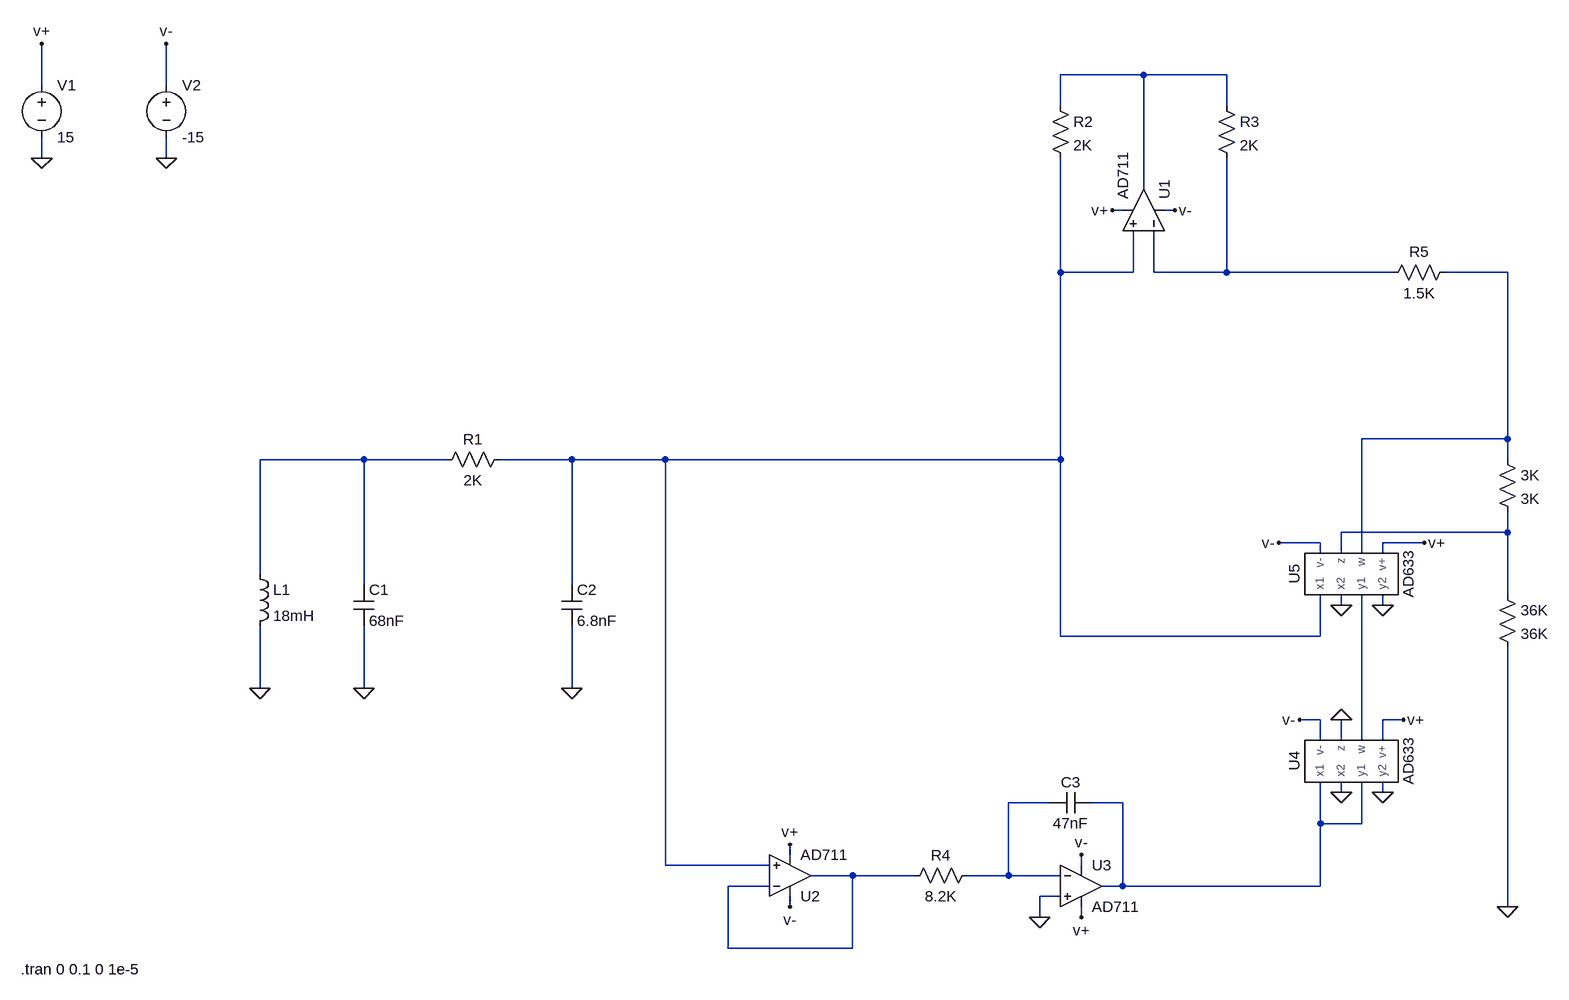
[diagram p0: schematic Draft1.asc]
Draft1.asc, the LTspice schematic file:
Version 4.1
SHEET 1 1716 784
WIRE 1088 -608 960 -608
WIRE 1216 -608 1088 -608
WIRE -608 -592 -608 -656
WIRE -416 -592 -416 -656
WIRE 960 -560 960 -608
WIRE 1216 -560 1216 -608
WIRE -608 -480 -608 -512
WIRE -416 -480 -416 -512
WIRE 1088 -432 1088 -608
WIRE 1056 -400 1040 -400
WIRE 1136 -400 1120 -400
WIRE 960 -304 960 -480
WIRE 1072 -304 1072 -368
WIRE 1072 -304 960 -304
WIRE 1104 -304 1104 -368
WIRE 1216 -304 1216 -480
WIRE 1216 -304 1104 -304
WIRE 1472 -304 1216 -304
WIRE 1648 -304 1552 -304
WIRE 1648 -48 1648 -304
WIRE 1648 -48 1424 -48
WIRE -112 -16 -272 -16
WIRE 16 -16 -112 -16
WIRE 208 -16 96 -16
WIRE 352 -16 208 -16
WIRE 960 -16 960 -304
WIRE 960 -16 352 -16
WIRE 1648 -16 1648 -48
WIRE 1648 96 1648 64
WIRE 1648 96 1392 96
WIRE 1360 112 1296 112
WIRE 1520 112 1456 112
WIRE 1360 128 1360 112
WIRE 1392 128 1392 96
WIRE 1424 128 1424 -48
WIRE 1456 128 1456 112
WIRE -272 160 -272 -16
WIRE -112 176 -112 -16
WIRE 208 176 208 -16
WIRE 1648 192 1648 96
WIRE 1392 208 1392 192
WIRE 1456 208 1456 192
WIRE 960 256 960 -16
WIRE 1360 256 1360 192
WIRE 1360 256 960 256
WIRE -272 336 -272 240
WIRE -112 336 -112 240
WIRE 208 336 208 240
WIRE 1360 384 1328 384
WIRE 1488 384 1456 384
WIRE 1360 416 1360 384
WIRE 1392 416 1392 384
WIRE 1424 416 1424 192
WIRE 1456 416 1456 384
WIRE 1392 496 1392 480
WIRE 1456 496 1456 480
WIRE 944 512 880 512
WIRE 1056 512 1008 512
WIRE 1360 544 1360 480
WIRE 1424 544 1424 480
WIRE 1424 544 1360 544
WIRE 544 592 544 576
WIRE 352 608 352 -16
WIRE 512 608 352 608
WIRE 992 608 992 592
WIRE 640 624 576 624
WIRE 736 624 640 624
WIRE 880 624 880 512
WIRE 880 624 816 624
WIRE 960 624 880 624
WIRE 512 640 448 640
WIRE 1056 640 1056 512
WIRE 1056 640 1024 640
WIRE 1360 640 1360 544
WIRE 1360 640 1056 640
WIRE 960 656 928 656
WIRE 544 672 544 656
WIRE 1648 672 1648 272
WIRE 928 688 928 656
WIRE 992 688 992 672
WIRE 448 736 448 640
WIRE 640 736 640 624
WIRE 640 736 448 736
FLAG 928 688 0
FLAG 1456 496 0
FLAG 1392 496 0
FLAG 1392 384 0
FLAG 1392 208 0
FLAG 1456 208 0
FLAG -272 336 0
FLAG -112 336 0
FLAG 208 336 0
FLAG -608 -480 0
FLAG -416 -480 0
FLAG -608 -656 v+
FLAG 544 576 v+
FLAG 992 688 v+
FLAG 1040 -400 v+
FLAG -416 -656 v-
FLAG 544 672 v-
FLAG 992 592 v-
FLAG 1136 -400 v-
FLAG 1648 672 0
FLAG 1488 384 v+
FLAG 1328 384 v-
FLAG 1296 112 v-
FLAG 1520 112 v+
SYMBOL ind -288 144 R0
SYMATTR InstName L1
SYMATTR Value 18mH
SYMBOL cap -128 176 R0
SYMATTR InstName C1
SYMATTR Value 68nF
SYMBOL cap 192 176 R0
SYMATTR InstName C2
SYMATTR Value 6.8nF
SYMBOL res 112 -32 R90
WINDOW 0 0 56 VBottom 2
WINDOW 3 32 56 VTop 2
SYMATTR InstName R1
SYMATTR Value 2K
SYMBOL OpAmps\\AD711 1152 -400 M270
SYMATTR InstName U1
SYMBOL res 944 -576 R0
SYMATTR InstName R2
SYMATTR Value 2K
SYMBOL res 1200 -576 R0
SYMATTR InstName R3
SYMATTR Value 2K
SYMBOL OpAmps\\AD711 544 688 M180
SYMATTR InstName U2
SYMBOL OpAmps\\AD711 992 576 R0
SYMATTR InstName U3
SYMBOL cap 1008 496 R90
WINDOW 0 0 32 VBottom 2
WINDOW 3 32 32 VTop 2
SYMATTR InstName C3
SYMATTR Value 47nF
SYMBOL res 832 608 R90
WINDOW 0 0 56 VBottom 2
WINDOW 3 32 56 VTop 2
SYMATTR InstName R4
SYMATTR Value 8.2K
SYMBOL AD633 1408 448 R270
SYMATTR InstName U4
SYMBOL AD633 1408 160 R270
SYMATTR InstName U5
SYMBOL res 1568 -320 R90
WINDOW 0 0 56 VBottom 2
WINDOW 3 32 56 VTop 2
SYMATTR InstName R5
SYMATTR Value 1.5K
SYMBOL res 1632 -32 R0
SYMATTR InstName 3K
SYMATTR Value 3K
SYMBOL res 1632 176 R0
SYMATTR InstName 36K
SYMATTR Value 36K
SYMBOL voltage -608 -608 R0
WINDOW 123 0 0 Left 0
WINDOW 39 0 0 Left 0
SYMATTR InstName V1
SYMATTR Value 15
SYMBOL voltage -416 -608 R0
WINDOW 123 0 0 Left 0
WINDOW 39 0 0 Left 0
SYMATTR InstName V2
SYMATTR Value -15
TEXT -640 768 Left 2 !.tran 0 0.1 0 1e-5

The netlist it stands for:
* Draft1.asc
L1 N005 0 18mH
C1 N005 0 68nF
C2 N002 0 6.8nF
R1 N002 N005 2K
X§U1 N002 N003 v- v+ N001 AD712  ; AD711, pins In+ In- V+ V- OUT
R2 N001 N002 2K
R3 N001 N003 2K
X§U2 N002 N010 v- v+ N010 AD712  ; AD711, pins In+ In- V+ V- OUT
X§U3 0 N008 v- v+ N009 AD712  ; AD711, pins In+ In- V+ V- OUT
C3 N009 N008 47nF
R4 N008 N010 8.2K
X§U4 N009 0 N009 0 v- 0 N007 v+ AD633  ; pins x1 x2 y1 y2 v- z w v+
X§U5 N002 0 N007 0 v- N006 N004 v+ AD633  ; pins x1 x2 y1 y2 v- z w v+
R5 N004 N003 1.5K
R§3K N004 N006 3K
R§36K N006 0 36K
V1 v+ 0 15
V2 v- 0 -15
.tran 0 0.1 0 1e-5
.lib ADI1.lib
.lib C:\Users\Arsh\Desktop\ad633.cir
.backanno
.end